# EAGLE design 3-bit-counter (EAGLE 8.3.2)
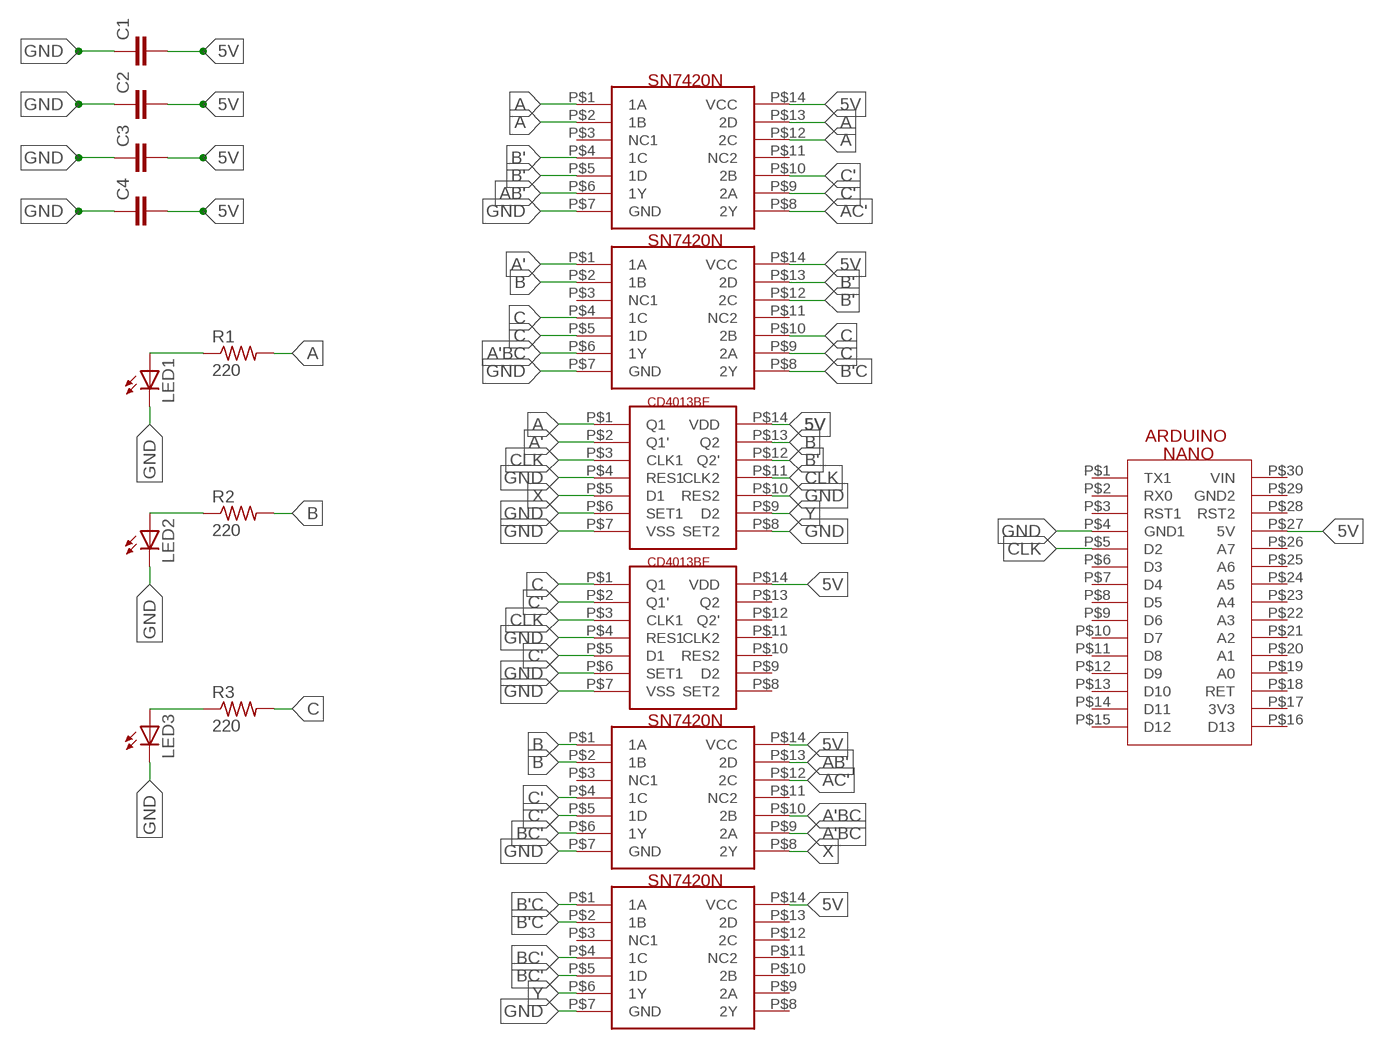
[diagram p0: schematic, sheet 1]

## Parts
C1  C2,5-3  [C2.5-3]
C2  C2,5-3  [C2.5-3]
C3  C2,5-3  [C2.5-3]
C4  C2,5-3  [C2.5-3]
DFF1  MC_DFFDIP14  [DIP14]
DFF2  MC_DFFDIP14  [DIP14]
LED1  LED5MM  [LED5MM]
LED2  LED5MM  [LED5MM]
LED3  LED5MM  [LED5MM]
NAND1  MC_NANDDIP14  [DIP14]
NAND2  MC_NANDDIP14  [DIP14]
NAND3  MC_NANDDIP14  [DIP14]
NAND4  MC_NANDDIP14  [DIP14]
R1  220  R-US_0204/7  [0204/7]
R2  220  R-US_0204/7  [0204/7]
R3  220  R-US_0204/7  [0204/7]
U$7  MC_NANO  [MC_NANO]

## Nets
5V: C1.2 C2.2 C3.2 C4.2 DFF1.P$14(VDD) DFF2.P$14(VDD) NAND1.P$14(VCC) NAND2.P$14(VCC) NAND3.P$14(VCC) NAND4.P$14(VCC) U$7.P$27(5V)
A: DFF1.P$1(Q1) NAND1.P$1(1A) NAND1.P$2(1B) NAND1.P$12(2C) NAND1.P$13(2D) R1.2
A': DFF1.P$2(Q1') NAND2.P$1(1A)
A'BC: NAND2.P$6(1Y) NAND3.P$9(2A) NAND3.P$10(2B)
AB': NAND1.P$6(1Y) NAND3.P$13(2D)
AC': NAND1.P$8(2Y) NAND3.P$12(2C)
B: DFF1.P$13(Q2) NAND2.P$2(1B) NAND3.P$1(1A) NAND3.P$2(1B) R2.2
B': DFF1.P$12(Q2') NAND1.P$4(1C) NAND1.P$5(1D) NAND2.P$12(2C) NAND2.P$13(2D)
B'C: NAND2.P$8(2Y) NAND4.P$1(1A) NAND4.P$2(1B)
BC': NAND3.P$6(1Y) NAND4.P$4(1C) NAND4.P$5(1D)
C: DFF2.P$1(Q1) NAND2.P$4(1C) NAND2.P$5(1D) NAND2.P$9(2A) NAND2.P$10(2B) R3.2
C': DFF2.P$2(Q1') DFF2.P$5(D1) NAND1.P$9(2A) NAND1.P$10(2B) NAND3.P$4(1C) NAND3.P$5(1D)
CLK: DFF1.P$3(CLK1) DFF1.P$11(CLK2) DFF2.P$3(CLK1) U$7.P$5(D2)
GND: C1.1 C2.1 C3.1 C4.1 DFF1.P$4(RES1) DFF1.P$6(SET1) DFF1.P$7(VSS) DFF1.P$8(SET2) DFF1.P$10(RES2) DFF2.P$4(RES1) DFF2.P$6(SET1) DFF2.P$7(VSS) LED1.K(C) LED2.K(C) LED3.K(C) NAND1.P$7(GND) NAND2.P$7(GND) NAND3.P$7(GND) NAND4.P$7(GND) U$7.P$4(GND1)
N$1: LED3.A R3.1
N$2: LED2.A R2.1
N$3: LED1.A R1.1
X: DFF1.P$5(D1) NAND3.P$8(2Y)
Y: DFF1.P$9(D2) NAND4.P$6(1Y)
Unconnected: DFF2.P$8(SET2) DFF2.P$9(D2) DFF2.P$10(RES2) DFF2.P$11(CLK2) DFF2.P$12(Q2') DFF2.P$13(Q2) NAND1.P$3(NC1) NAND1.P$11(NC2) NAND2.P$3(NC1) NAND2.P$11(NC2) NAND3.P$3(NC1) NAND3.P$11(NC2) NAND4.P$3(NC1) NAND4.P$8(2Y) NAND4.P$9(2A) NAND4.P$10(2B) NAND4.P$11(NC2) NAND4.P$12(2C) NAND4.P$13(2D) U$7.P$1(TX1) U$7.P$2(RX0) U$7.P$3(RST1) U$7.P$6(D3) U$7.P$7(D4) U$7.P$8(D5) U$7.P$9(D6) U$7.P$10(D7) U$7.P$11(D8) U$7.P$12(D9) U$7.P$13(D10) U$7.P$14(D11) U$7.P$15(D12) U$7.P$16(D13) U$7.P$17(3V3) U$7.P$18(RET) U$7.P$19(A0) U$7.P$20(A1) U$7.P$21(A2) U$7.P$22(A3) U$7.P$23(A4) U$7.P$24(A5) U$7.P$25(A6) U$7.P$26(A7) U$7.P$28(RST2) U$7.P$29(GND2) U$7.P$30(VIN)

## Library data of the parts
C1-C4 = capacitor-wima:C: CAPACITOR naming: grid - package width
DFF1 DFF2 = MC_DFF:MC_DFF
LED1-LED3 = led:LED: LED OSRAM: - CHIPLED LG R971, LG N971, LY N971, LG Q971, LY Q971, LO R971, LY R971 LH N974, LH R974 LS Q976, LO Q976, LY Q976 LO Q996 - Hyper CHIPLED LW Q18S LB Q993, LB Q99A, LB R99A - SideLED LS A670, LO A670, LY A670, LG A670, LP A670 LB A673, LV A673, LT A673, LW A673 LH A674 LY A675 LS A676, LA A676, LO A676, LY A676, LW A676 LS A679, LY A679, LG A679 - Hyper Micro SIDELED® LS Y876, LA Y876, LO Y876, LY Y876 LT Y87S - SmartLED LW L88C, LW L88S LB L89C, LB L89S, LG L890 LS L89K, LO L89K, LY L89K LS L896, LA L896, LO L896, LY L896 - TOPLED LS T670, LO T670, LY T670, LG T670, LP T670 LSG T670, LSP T670, LSY T670, LOP T670, LYG T670 LG T671, LOG T671, LSG T671 LB T673, LV T673, LT T673, LW T673 LH T674 LS T676, LA T676, LO T676, LY T676, LB T676, LH T676, LSB T676, LW T676 LB T67C, LV T67C, LT T67C, LS T67K, LO T67K, LY T67K, LW E67C LS E67B, LA E67B, LO E67B, LY E67B, LB E67C, LV E67C, LT E67C LW T67C LS T679, LY T679, LG T679 LS T770, LO T770, LY T770, LG T770, LP T770 LB T773, LV T773, LT T773, LW T773 LH T774 LS E675, LA E675, LY E675, LS T675 LS T776, LA T776, LO T776, LY T776, LB T776 LHGB T686 LT T68C, LB T68C - Hyper Mini TOPLED® LB M676 - Mini TOPLED Santana® LG M470 LS M47K, LO M47K, LY M47K Source: http://www.osram.convergy.de LUXEON: - LUMILED® LXK2-PW12-R00, LXK2-PW12-S00, LXK2-PW14-U00, LXK2-PW14-V00 LXK2-PM12-R00, LXK2-PM12-S00, LXK2-PM14-U00 LXK2-PE12-Q00, LXK2-PE12-R00, LXK2-PE12-S00, LXK2-PE14-T00, LXK2-PE14-U00 LXK2-PB12-K00, LXK2-PB12-L00, LXK2-PB12-M00, LXK2-PB14-N00, LXK2-PB14-P00, LXK2-PB14-Q00 LXK2-PR12-L00, LXK2-PR12-M00, LXK2-PR14-Q00, LXK2-PR14-R00 LXK2-PD12-Q00, LXK2-PD12-R00, LXK2-PD12-S00 LXK2-PH12-R00, LXK2-PH12-S00 LXK2-PL12-P00, LXK2-PL12-Q00, LXK2-PL12-R00 Source: www.luxeon.com KINGBRIGHT: KA-3528ASYC Source: www.kingbright.com
NAND1-NAND4 = MC_NAND:MC_NAND
R1-R3 = rcl:R-US_: RESISTOR, American symbol
U$7 = MC_NANO:MC_NANO

## Board
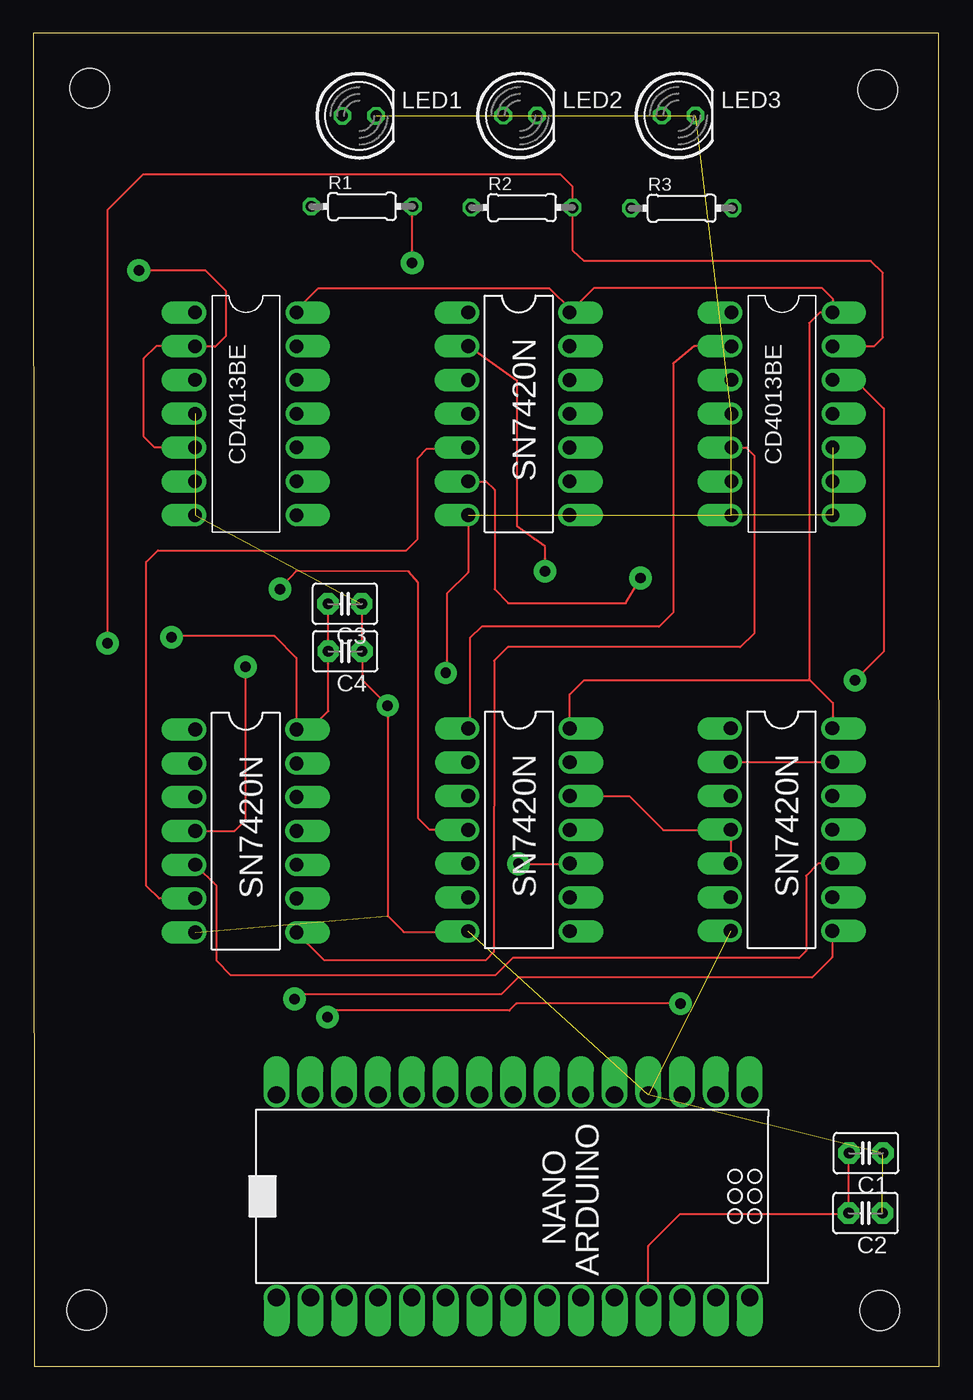
[diagram p1: board, top side]
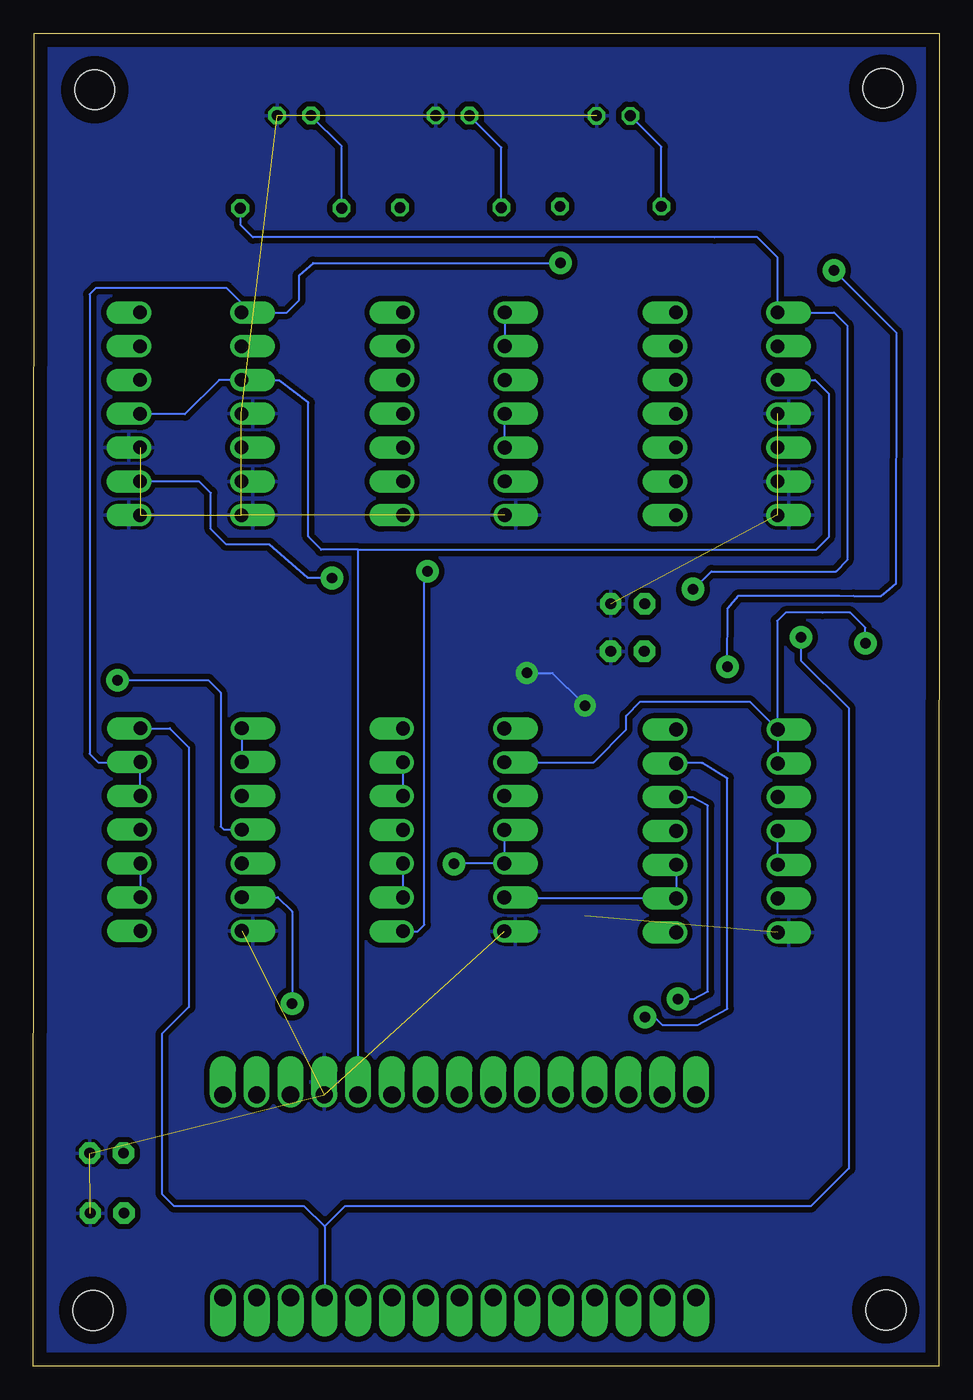
[diagram p2: board, bottom side, seen from below]

Size 68.1 x 100.22 mm. Coordinates in mm from the lower left corner, seen from the top.
Outline: 0.06,0 68.11,0 68.05,100.22 0,100.22 0.06,0
Copper layers (1*16): Top 0.035mm / dielectric 1.5mm / Bottom 0.035mm
Design rules "default": minimum track width 6mil, minimum drill 0.35mm, track to track 6mil, track to pad 6mil, pad to pad 6mil, via to via 6mil, smd to smd 6mil, copper to edge 40mil, drill to drill 6mil, minimum pad ring 10mil, minimum via ring 8mil, stop-mask expansion 4mil, vias tented up to drill 0mil, thermal gap 10mil
Holes 3 mm at 4.25,96.08 63.48,95.98 4.02,4.23 63.62,4.19

### Footprints (pad centres in the part's own frame; a part is rotated, then mirrored left to right if it is on the bottom)
C2.5-3 = drill 0.813 pad 1.6 octagon: 1 -1.27,0; 2 1.27,0
DIP14 = drill 1.016 pad 1.676 offset: P$1 0,0; P$2 0,-2.54; P$3 0,-5.08; P$4 0,-7.62; P$5 0,-10.16; P$6 0,-12.7; P$7 0,-15.24; P$8 7.62,-15.24; P$9 7.62,-12.7; P$10 7.62,-10.16; P$11 7.62,-7.62; P$12 7.62,-5.08; P$13 7.62,-2.54; P$14 7.62,0
LED5MM = drill 0.813 octagon: A -1.27,0; K 1.27,0
DIP14' = drill 1.041 pad 1.676 offset: P$1 0,0; P$2 0,-2.54; P$3 0,-5.08; P$4 0,-7.62; P$5 0,-10.16; P$6 0,-12.7; P$7 0,-15.24; P$8 7.62,-15.24; P$9 7.62,-12.7; P$10 7.62,-10.16; P$11 7.62,-7.62; P$12 7.62,-5.08; P$13 7.62,-2.54; P$14 7.62,0
0204/7 = drill 0.813 octagon: 1 -3.81,0; 2 3.81,0
MC_NANO = drill 1.3 pad 1.905 offset: P$1 -7.62,7.62; P$2 -7.62,5.08; P$3 -7.62,2.54; P$4 -7.62,0; P$5 -7.62,-2.54; P$6 -7.62,-5.08; P$7 -7.62,-7.62; P$8 -7.62,-10.16; P$9 -7.62,-12.7; P$10 -7.62,-15.24; P$11 -7.62,-17.78; P$12 -7.62,-20.32; P$13 -7.62,-22.86; P$14 -7.62,-25.4; P$15 -7.62,-27.94; P$16 7.62,-27.94; P$17 7.62,-25.4; P$18 7.62,-22.86; P$19 7.62,-20.32; P$20 7.62,-17.78; P$21 7.62,-15.24; P$22 7.62,-12.7; P$23 7.62,-10.16; P$24 7.62,-7.62; P$25 7.62,-5.08; P$26 7.62,-2.54; P$27 7.62,0; P$28 7.62,2.54; P$29 7.62,5.08; P$30 7.62,7.62

### Placement (x,y rotation side)
C1  62.59,16.02 180 top
C2  62.55,11.51 180 top
C3  23.43,57.32 180 top
C4  23.44,53.75 180 top
DFF1  52.46,79.23 0 top
DFF2  12.17,79.23 0 top
LED1  24.5,94.02 0 top
LED2  36.59,94.03 0 top
LED3  48.51,94.03 0 top
NAND1  MC_NANDDIP14  [DIP14']  52.43,47.96 0 top
NAND2  MC_NANDDIP14  [DIP14']  32.7,47.95 0 top
NAND3  MC_NANDDIP14  [DIP14']  12.16,47.87 0 top
NAND4  MC_NANDDIP14  [DIP14']  32.68,79.23 0 top
R1  24.71,87.2 0 top
R2  36.73,87.12 0 top
R3  48.74,87.07 0 top
U$7  46.23,12.78 270 top

### Tracks (layer width: path | path; a pad name or v marks a point on that pad's centre or on a via)
5V  (via drill 0.79 pad 1.7)
  Top 0.152: 40.46,79.39 42.14,81.07 59.29,81.07 60.08,80.27 DFF1.P$14 59.12,79.23 58.32,78.43 58.32,51.65 58.37,51.6 | 40.46,79.39 NAND4.P$14 | 58.37,51.6 60.1,49.87 60.1,48.02 NAND1.P$14 | NAND2.P$14 40.32,50.51 41.4,51.59 58.36,51.59 58.37,51.6 | DFF2.P$14 19.79,79.42 21.43,81.06 38.79,81.06 40.46,79.39 | 46.26,5.19 U$7.P$27 46.23,9.04 48.64,11.45 61.22,11.45 C2.2 61.28,15.99 C1.2 | v10.4,54.82 10.48,54.89 18.14,54.89 19.78,53.25 NAND3.P$14 20.8,47.87 22.19,49.26 22.19,53.73 C4.2 22.17,57.3 C3.2
  Bottom 0.152: v10.4,54.82 10.4,53.07 6.81,49.48 6.81,14.87 9.64,12.04 44.68,12.04 46.21,10.51 | 46.21,10.51 46.21,5.18 U$7.P$27 | NAND1.P$14 57.84,47.96 56.41,46.53 56.41,27.01 58.44,24.98 58.44,12.97 57.53,12.06 47.76,12.06 46.21,10.51
A  (via drill 0.79 pad 1.7)
  Top 0.152: NAND1.P$2 NAND1.P$13 | v28.48,82.94 28.48,87.16 R1.2
  Bottom 0.152: NAND1.P$1 NAND1.P$2 | NAND1.P$12 NAND1.P$13 60.09,45.38 63.21,45.38 63.88,46.05 63.88,80.6 63.41,81.07 53.57,81.07 52.46,79.96 DFF1.P$1 49.04,79.23 48.12,80.15 48.12,82.02 47.07,82.94 29.11,82.94 v28.48,82.94
A'
  Top 0.152: DFF1.P$2 49.69,76.69 48.09,75.39 48.1,56.67 47.04,55.61 33.7,55.61 32.81,54.73 32.81,48.06 NAND2.P$1
A'BC
  Bottom 0.152: NAND3.P$10 NAND3.P$9 32.62,35.17 NAND2.P$6
AB'  (via drill 0.79 pad 1.7)
  Top 0.152: v48.64,27.27 36.31,27.27 35.79,26.74 22.61,26.74 v22.12,26.25
  Bottom 0.152: NAND1.P$6 49.73,35.26 48.64,34.18 v48.64,27.27 | v22.12,26.25 21.43,26.25 20.83,25.66 18.18,25.66 15.94,26.88 15.94,44.19 17.83,45.35 19.76,45.35 NAND3.P$13
AC'  (via drill 0.79 pad 1.7)
  Top 0.152: NAND1.P$8 60.05,30.74 58.53,29.22 36.45,29.22 35.19,27.97 19.99,27.97 v19.64,27.62
  Bottom 0.152: v19.64,27.62 18.46,27.62 17.41,28.17 17.41,42.15 18.53,42.77 19.77,42.77 NAND3.P$12
B  (via drill 0.79 pad 1.7)
  Top 0.152: DFF1.P$13 63.21,76.69 63.86,77.34 63.85,82.22 62.96,83.1 41.42,83.1 40.56,83.86 R2.2 40.54,88.69 39.64,89.59 8.24,89.59 5.56,86.91 5.56,56.88 v5.57,54.34
  Bottom 0.152: NAND3.P$2 NAND3.P$1 12.27,47.97 | NAND2.P$2 25.99,45.41 23.54,47.86 23.54,48.91 22.48,49.97 14.26,49.97 12.27,47.97 | v5.57,54.34 5.57,55.53 6.71,56.67 8.79,56.67 8.81,56.66 11.57,56.66 12.2,56.05 12.2,48.05 12.27,47.97
B'  (via drill 0.79 pad 1.7)
  Top 0.152: 52.43,40.28 NAND1.P$5 | 52.43,40.28 NAND1.P$4 | DFF1.P$12 61.8,74.15 63.93,72.01 63.93,53.75 v61.77,51.58 | NAND2.P$12 44.78,42.87 47.33,40.32 52.39,40.32 52.43,40.28
  Bottom 0.152: v61.77,51.58 54.95,51.58 54.02,50.65 54.02,40.58 53.78,40.35 NAND1.P$4 | NAND2.P$13 NAND2.P$12
B'C  (via drill 0.79 pad 1.7)
  Top 0.152: v38.46,59.76 38.46,61.61 37.67,62.19 37.63,62.22 36.37,63.14 36.37,74.08 NAND4.P$2
  Bottom 0.152: NAND4.P$1 NAND4.P$2 | NAND2.P$8 39.2,32.71 38.72,33.2 38.72,59.51 v38.46,59.76
BC'
  Top 0.152: NAND3.P$6 9.45,35.17 8.49,36.13 8.49,60.48 9.36,61.34 28.03,61.34 28.88,62.19 28.88,68.28 29.59,68.98 32.59,68.98 NAND4.P$5
  Bottom 0.152: NAND4.P$5 NAND4.P$4
C  (via drill 0.79 pad 1.7)
  Top 0.152: NAND2.P$4 29.8,40.33 28.93,41.2 28.93,58.92 28.23,59.76 19.75,59.8 v18.53,58.43 | v36.47,37.77 40.3,37.77 NAND2.P$10
  Bottom 0.152: R3.2 52.55,85.82 51.6,84.88 16.92,84.88 13.68,84.88 12.17,83.37 DFF2.P$1 7.91,79.23 6.93,78.25 6.93,60.6 7.77,59.76 17.14,59.76 18.47,58.43 v18.53,58.43 | NAND2.P$10 NAND2.P$9 | NAND2.P$4 NAND2.P$5 36.45,37.79 v36.47,37.77
C'  (via drill 0.79 pad 1.7)
  Top 0.152: DFF2.P$5 9.13,69.07 8.32,69.88 8.32,75.78 9.25,76.71 12.04,76.71 | 12.04,76.71 12.15,76.71 DFF2.P$2 | NAND1.P$10 59.01,37.8 58.08,36.87 58.08,31.21 57.55,30.69 36.03,30.69 34.74,29.4 14.86,29.4 13.77,30.48 13.77,36.1 NAND3.P$5 | NAND3.P$4 15.13,40.25 15.96,41.08 15.96,52.58 v15.94,52.6 | v7.93,82.4 12.92,82.4 14.47,80.85 14.47,77.46 13.68,76.66 12.09,76.66 12.04,76.71
  Bottom 0.152: NAND1.P$10 NAND1.P$9 | NAND3.P$5 NAND3.P$4 | v15.94,52.6 15.92,56.98 15.08,57.93 7.49,57.93 6.46,57.91 4.42,57.9 3.77,58.42 3.76,58.42 3.25,58.88 3.22,77.69 v7.93,82.4
CLK
  Bottom 0.152: DFF2.P$3 9.35,74.15 8.32,73.13 8.32,62.34 9.27,61.39 43.68,61.39 | 43.68,61.39 46.47,61.4 47.42,62.38 47.42,72.45 49.62,74.11 52.42,74.11 DFF1.P$3 54.13,74.15 56.7,71.58 60.05,71.58 DFF1.P$11 | U$7.P$5 43.69,61.38 43.68,61.39
GND  (via drill 0.79 pad 1.65)  (16 unrouted)
  Top 0.152: NAND4.P$7 32.68,59.69 31.09,58.1 31.09,52.21 | NAND2.P$7 32.63,32.65 27.83,32.65 26.64,33.84 v26.64,49.67 24.71,51.6 C4.1 24.7,53.77 C3.1
  Top 0.406: 31.09,52.21 v31,52.12
  Bottom 0.152: v31,52.12 29.09,52.12 26.78,49.81
  Bottom 0.406: 26.78,49.81 v26.64,49.67
  pour Bottom (isolate 0.406): 0.17,100.23 67.99,100.23 67.99,-1.37 0.17,-1.37
N$1
  Bottom 0.152: R3.1 44.93,91.72 LED3.A
N$2
  Bottom 0.152: R2.1 32.92,91.63 LED2.A
N$3
  Bottom 0.152: R1.1 20.9,91.69 LED1.A
X
  Top 0.152: DFF1.P$5 53.6,69.07 54.2,68.47 54.2,55.09 53.13,54.06 35.66,54.06 34.64,53.05 34.63,31.13 34.02,30.53 21.88,30.53 NAND3.P$8
Y  (via drill 0.79 pad 1.7)
  Top 0.152: NAND4.P$6 34.04,66.53 34.67,65.9 34.67,58.43 35.69,57.37 44.54,57.37 v45.64,59.26
  Bottom 0.152: v45.64,59.26 47.49,59.26 50.36,61.79 53.61,61.79 54.76,62.94 54.76,65.65 55.63,66.53 DFF1.P$9